# EAGLE design SSB Transceiver_IF Amplifier (EAGLE 9.4.2)
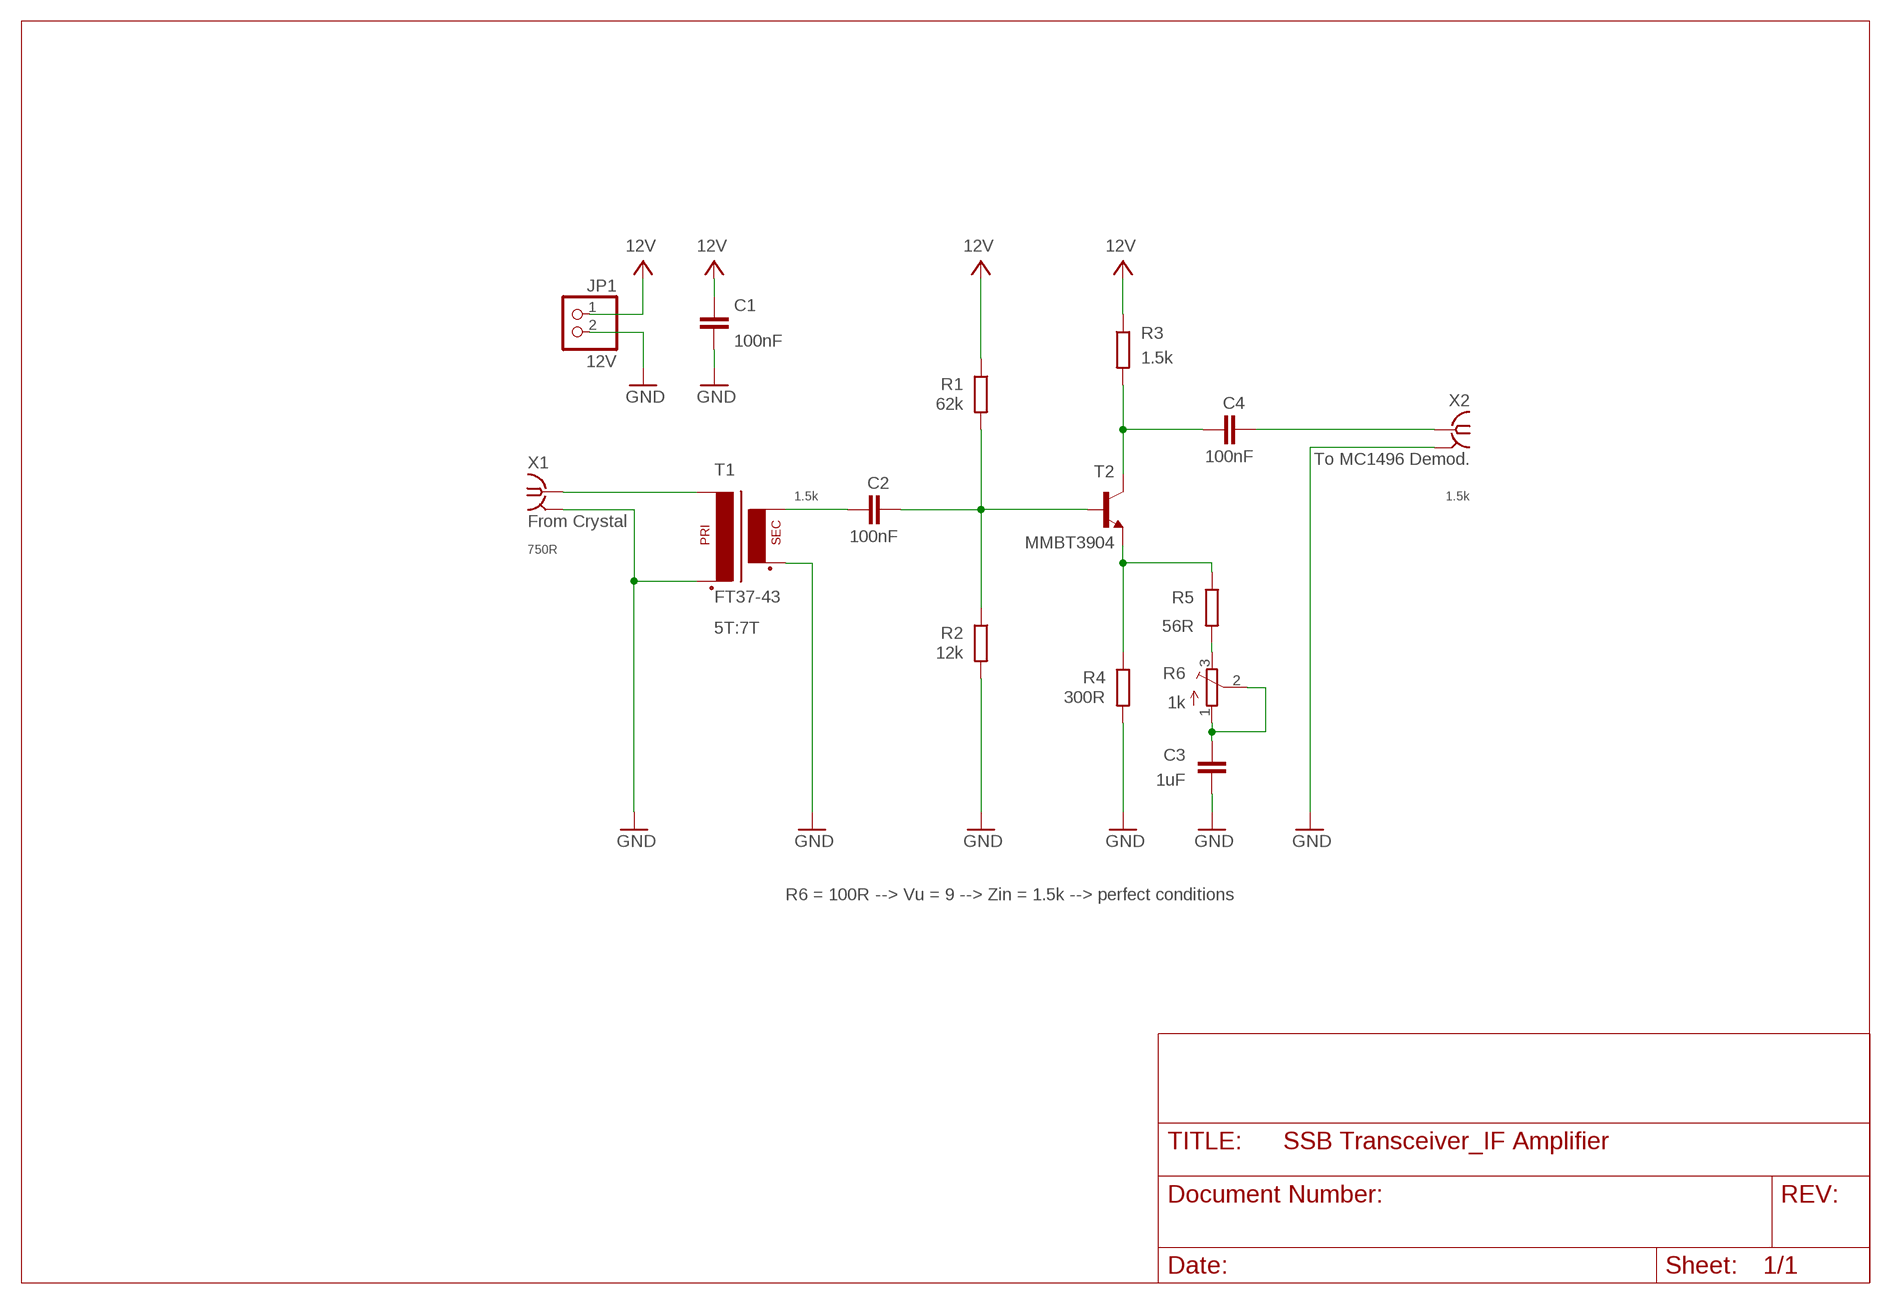
[diagram p0: schematic, sheet 1]

## Parts
C1  100nF  C-EUC0805  [C0805]
C2  100nF  C-EUC0805  [C0805]
C3  1uF  C-EUC0805  [C0805]
C4  100nF  C-EUC0805  [C0805]
JP1  12V  PINHD-1X2  [1X02]
R1  62k  R-EU_R0805  [R0805]
R2  12k  R-EU_R0805  [R0805]
R3  1.5k  R-EU_R0805  [R0805]
R4  300R  R-EU_R0805  [R0805]
R5  56R  R-EU_R0805  [R0805]
R6  1k  TRIM_EU-3223G  [3223G]
T1  FT37-43  [FT37-43SMD]
T2  MMBT3904  MMBT3904LT1-NPN-SOT23-BEC  [SOT23-BEC]
X1  From Crystal  SMA-PCB-CON142-0711-821/826  [J502-ND-142-0711-821/826]
X2  To MC1496 Demod.  SMA-PCB-CON142-0711-821/826  [J502-ND-142-0711-821/826]

## Nets
GND: C1.1 C3.1 JP1.2 R2.2 R4.2 T1.P$2(P2) T1.S$2(S2) X1.G@1 X1.G@2 X1.G@3 X1.G@4 X2.G@1 X2.G@2 X2.G@3 X2.G@4
N$1: R4.1 R5.1 T2.E
N$2: C3.2 R6.1(A) R6.2(S)
N$3: C4.1 R3.2 T2.C
N$4: T1.P$1(P1) X1.1
N$5: C2.2 R1.2 R2.1 T2.B
N$7: C4.2 X2.1
N$9: C2.1 T1.S$1(S1)
N$10: R5.2 R6.3(E)
VCC: C1.2 JP1.1 R1.1 R3.1 ; supply symbol labelled 12V

## Notes on the sheet
- 1.5k
- 1.5k
- 750R
- 5T:7T
- R6 = 100R --> Vu = 9 --> Zin = 1.5k --> perfect conditions

## Library data of the parts
C1-C4 = rcl:C-EU: CAPACITOR, European symbol; SPICEPREFIX: C
JP1 = pinhead:PINHD-1X2: PIN HEADER
R1-R5 = rcl:R-EU_: RESISTOR, European symbol; SPICEPREFIX: R
R6 = pot:TRIM_EU-: POTENTIOMETER
T1 = Ham Radio:FT37-43
T2 = transistor:*-NPN-: NPN Transistror BF959 corrected 2008.03.06
X1 X2 = Ham Radio:SMA-PCB-CON: SMA 50 Ohm End Launch Jack Receptacle - Round Contact Johnson Components Source: www.johnsoncomponents.com .. J502-ND.pdf; MF: JOHNSON COMPONENTS; MPN: 142-0711-821; OC_FARNELL: 1019328; OC_NEWARK: 16F3627

## Board
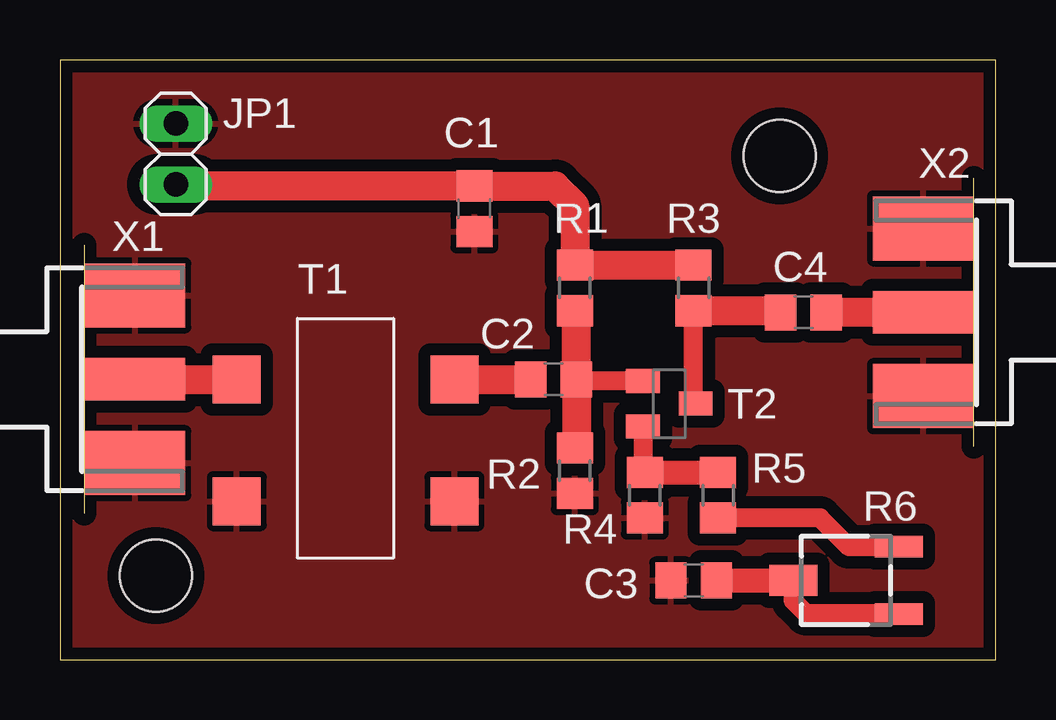
[diagram p1: board, top side]
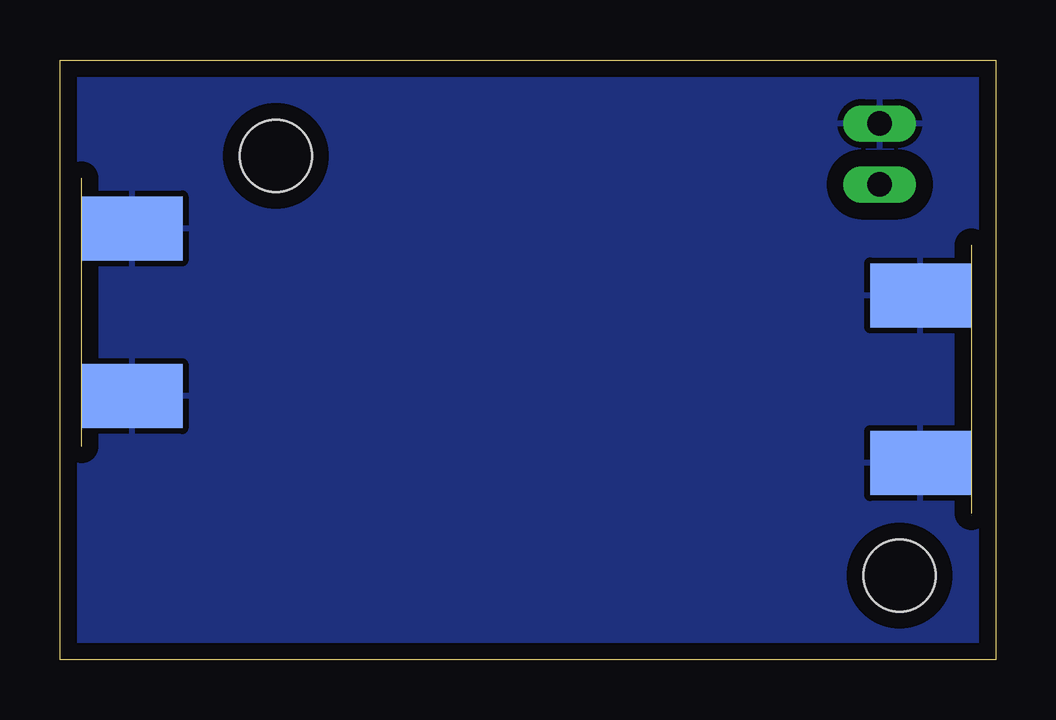
[diagram p2: board, bottom side, seen from below]

Size 39 x 25 mm. Coordinates in mm from the lower left corner, seen from the top.
Outline: 0,0 39,0 39,25 0,25 0,0
Copper layers (1*16): Top 0.035mm / dielectric 1.5mm / Bottom 0.035mm
Design rules "default *": minimum track width 6mil, minimum drill 0.35mm, track to track 20mil, track to pad 20mil, pad to pad 20mil, via to via 20mil, smd to smd 6mil, copper to edge 20mil, drill to drill 6mil, minimum pad ring 10mil, minimum via ring 8mil, stop-mask expansion 4mil, vias tented up to drill 0mil, thermal gap 10mil
Holes 3 mm at 4,3.5 30,21

### Footprints (pad centres in the part's own frame; a part is rotated, then mirrored left to right if it is on the bottom)
C0805 = smd 1.3 x 1.5: 1 -0.95,0; 2 0.95,0
1X02 = drill 1.016 long: 1 -1.27,0; 2 1.27,0
R0805 = smd 1.3 x 1.5: 1 -0.95,0; 2 0.95,0
3223G = smd 2 x 0.9: 1 -2.2,1.4; 3 -2.2,-1.4 | smd 2 x 1.3: 2 2.2,0
FT37-43SMD = smd 2 x 2: P$1 -5.08,0; P$2 -5.08,-5.08; S$1 4,0; S$2 4,-5.08
SOT23-BEC = smd 1 x 1.4: B -0.95,-1.1; C 0,1.1; E 0.95,-1.1
J502-ND-142-0711-821/826 = smd 4.191 x 1.778: 1 2.115,0 | smd 4.191 x 2.667: G@1 2.115,3.495; G@2 2.115,-3.495 | smd 4.191 x 2.667 bottom: G@3 2.115,3.495; G@4 2.115,-3.495

### Placement (x,y rotation side)
C1  17.27,18.8 90 top
C2  20.57,11.68 0 top
C3  26.42,3.3 0 top
C4  30.99,14.48 0 top
JP1  4.83,21.08 90 top
R1  21.46,15.49 270 top
R2  21.46,7.87 270 top
R3  26.42,15.49 270 top
R4  24.38,6.86 270 top
R5  27.43,6.86 270 top
R6  32.77,3.3 180 top
T1  12.45,11.68 0 top
T2  25.4,10.67 270 top
X1  1.02,11.68 0 top
X2  38.1,14.48 180 top

### Tracks (layer width: path | path; a pad name or v marks a point on that pad's centre or on a via)
GND
  pour Top (isolate 0.5): 0,0 0,25 39,25 39,0
  pour Bottom (isolate 0.7): 0,0 0,25 39,25 39,0
N$1
  Top 0.8: T2.E 24.3,7.89 R4.1
  Top 1: R4.1 R5.1
N$2
  Top 0.8: R6.1 31.12,1.9 30.57,2.45 R6.2
  Top 1: C3.2 R6.2
N$3
  Top 0.8: T2.C 26.42,10.75 R3.2
  Top 1.2: R3.2 29.97,14.54 C4.1
N$4
  Top 1.2: X1.1 T1.P$1
N$5
  Top 0.8: T2.B 21.59,11.62 C2.2
  Top 1.2: R2.1 21.52,8.88 C2.2 21.52,14.48 R1.2
N$7
  Top 1.2: X2.1 C4.2
N$9
  Top 1.2: T1.S$1 C2.1
N$10
  Top 0.8: R6.3 32.89,4.7 31.68,5.91 R5.2
VCC
  Top 1.2: JP1.1 4.89,19.75 C1.2 20.64,19.75 21.46,18.92 R1.1 R3.1